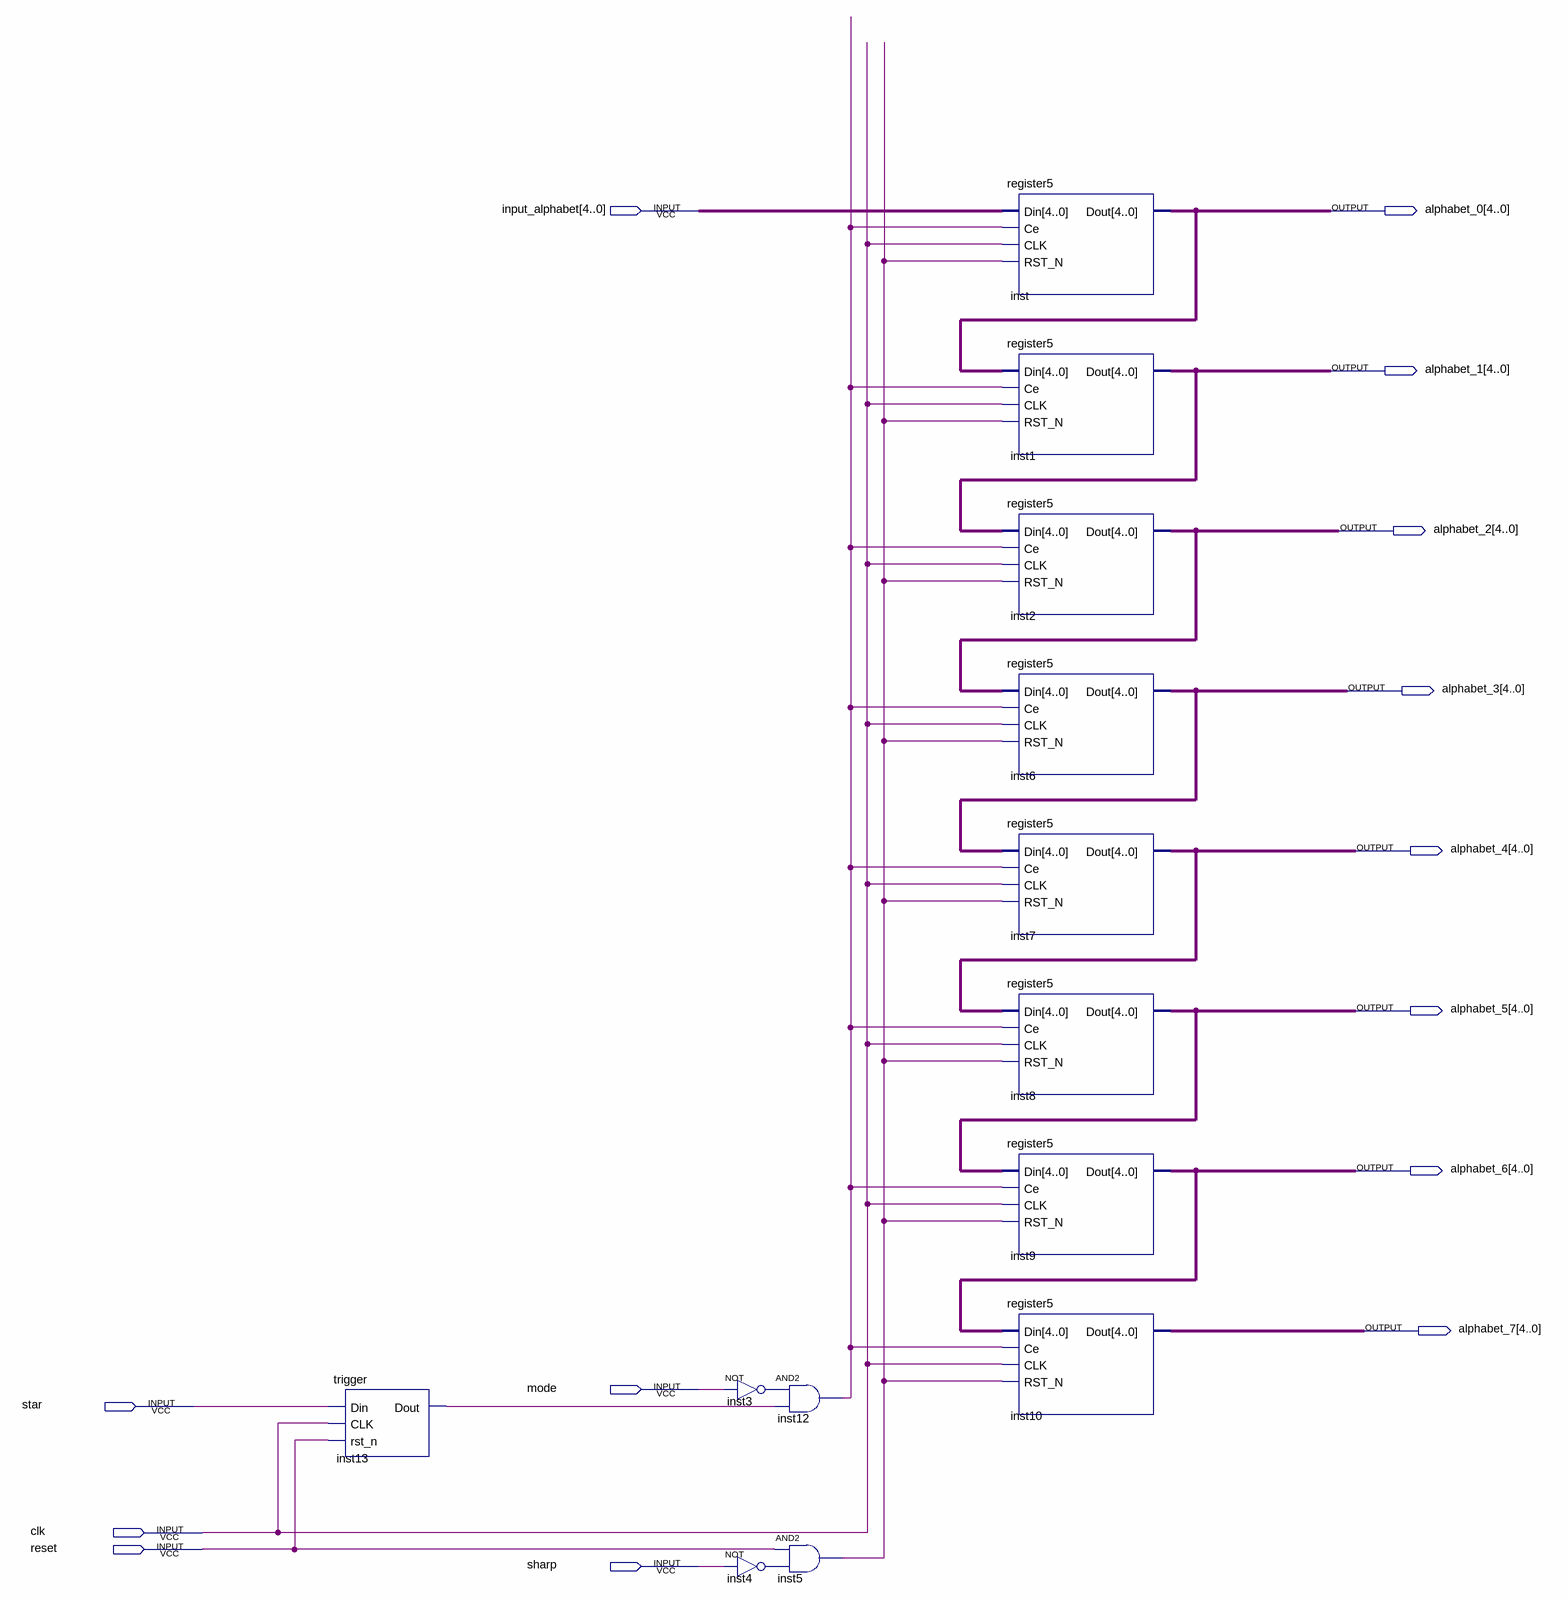
[diagram p0: schematic sheet]
// Quartus schematic word_register.bdf as structural Verilog: 13 symbols, 14 pins
module word_register (
  input  [4:0] input_alphabet,
  input  mode,
  input  star,
  input  clk,
  input  reset,
  input  sharp,
  output [4:0] alphabet_0,
  output [4:0] alphabet_1,
  output [4:0] alphabet_2,
  output [4:0] alphabet_3,
  output [4:0] alphabet_4,
  output [4:0] alphabet_5,
  output [4:0] alphabet_6,
  output [4:0] alphabet_7
);

  wire inst3_out, inst4_out, inst5_out, inst12_out, inst13_dout;

  trigger inst13 (.Din(star), .CLK(clk), .rst_n(reset), .Dout(inst13_dout));
  not inst3 (inst3_out, mode);
  not inst4 (inst4_out, sharp);
  and inst12 (inst12_out, inst3_out, inst13_dout);
  and inst5 (inst5_out, reset, inst4_out);
  register5 inst (.Din(input_alphabet), .Ce(inst12_out), .CLK(clk), .RST_N(inst5_out), .Dout(alphabet_0));
  register5 inst1 (.Din(alphabet_0), .Ce(inst12_out), .CLK(clk), .RST_N(inst5_out), .Dout(alphabet_1));
  register5 inst2 (.Din(alphabet_1), .Ce(inst12_out), .CLK(clk), .RST_N(inst5_out), .Dout(alphabet_2));
  register5 inst6 (.Din(alphabet_2), .Ce(inst12_out), .CLK(clk), .RST_N(inst5_out), .Dout(alphabet_3));
  register5 inst7 (.Din(alphabet_3), .Ce(inst12_out), .CLK(clk), .RST_N(inst5_out), .Dout(alphabet_4));
  register5 inst8 (.Din(alphabet_4), .Ce(inst12_out), .CLK(clk), .RST_N(inst5_out), .Dout(alphabet_5));
  register5 inst9 (.Din(alphabet_5), .Ce(inst12_out), .CLK(clk), .RST_N(inst5_out), .Dout(alphabet_6));
  register5 inst10 (.Din(alphabet_6), .Ce(inst12_out), .CLK(clk), .RST_N(inst5_out), .Dout(alphabet_7));
endmodule
